# Altium schematic sheet Modbus.SchDoc: Ethernet
size A4; SheetNumber: 5; SheetTotal: 6
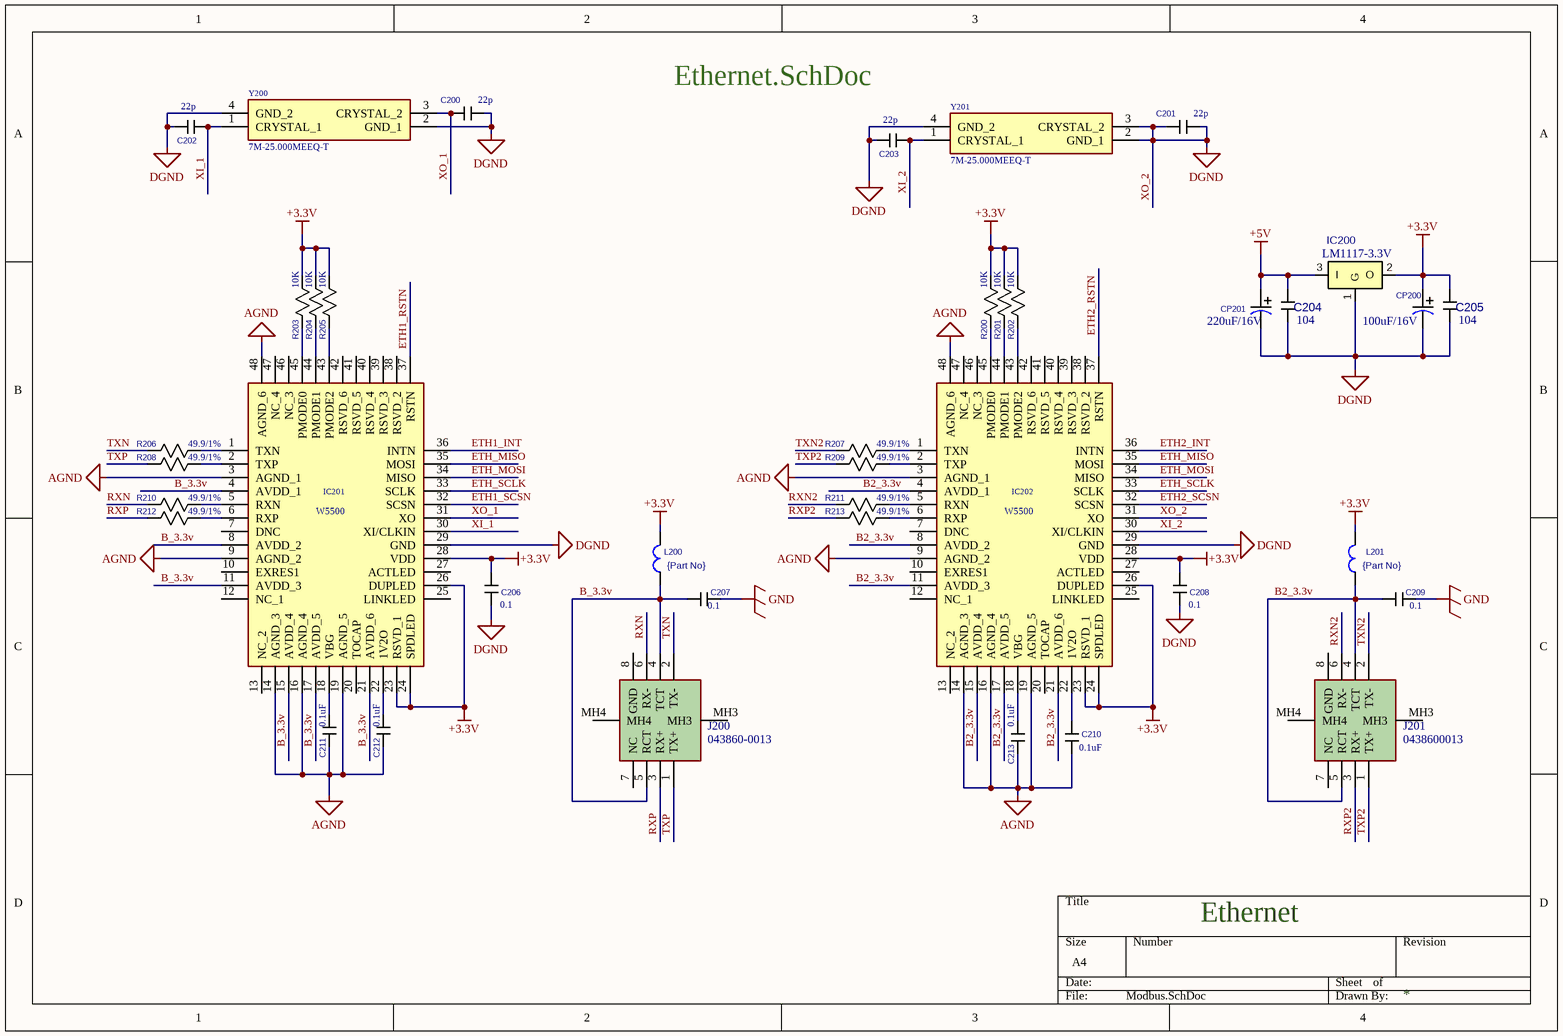
[diagram p0: Modbus.SchDoc]

## Parts
C200  규격: 22p  [CC1608]  (hidden comment: CS1608)
C201  규격: 22p  [CC1608]  (hidden comment: CS1608)
C202  규격: 22p  [CC1608]  (hidden comment: CS1608)
C203  규격: 22p  [CC1608]  (hidden comment: CS1608)
C204  규격: 104  [CC1608]  (hidden comment: CS1608)
C205  규격: 104  [CC1608]  (hidden comment: CS1608)
C206  규격: 0.1  [CC1608]  (hidden comment: CS1608)
C207  규격: 0.1  [CC1608]  (hidden comment: CS1608)
C208  규격: 0.1  [CC1608]  (hidden comment: CS1608)
C209  규격: 0.1  [CC1608]  (hidden comment: CS1608)
C210  규격: 0.1uF  [CC1608]  (hidden comment: CS1608)
C211  규격: 0.1uF  [CC1608]  (hidden comment: CS1608)
C212  규격: 0.1uF  [CC1608]  (hidden comment: CS1608)
C213  규격: 0.1uF  [CC1608]  (hidden comment: CS1608)
CP200  규격: 100uF/16V  [CP5_SMT]  (hidden comment: CP5_SMT)
CP201  규격: 220uF/16V  [CP6_SMT]  (hidden comment: CP6_SMT)
IC200  Part No.: LM1117-3.3V  [SOT-223]  (hidden comment: 1117SO)
IC201  W5500  [QFP50P900X900X160-48N]
IC202  W5500  [QFP50P900X900X160-48N]
J200  043860-0013  [0438600013]
J201  0438600013  [0438600013]
L200  Part No.: {Part No}  [BEADC2012X110N]  (hidden comment: L)
L201  Part No.: {Part No}  [BEADC2012X110N]  (hidden comment: L)
R200  규격: 10K  [R1608N]  (hidden comment: R1608)
R201  규격: 10K  [R1608N]  (hidden comment: R1608)
R202  규격: 10K  [R1608N]  (hidden comment: R1608)
R203  규격: 10K  [R1608N]  (hidden comment: R1608)
R204  규격: 10K  [R1608N]  (hidden comment: R1608)
R205  규격: 10K  [R1608N]  (hidden comment: R1608)
R206  규격: 49.9/1%  [R1608N]  (hidden comment: R1608)
R207  규격: 49.9/1%  [R1608N]  (hidden comment: R1608)
R208  규격: 49.9/1%  [R1608N]  (hidden comment: R1608)
R209  규격: 49.9/1%  [R1608N]  (hidden comment: R1608)
R210  규격: 49.9/1%  [R1608N]  (hidden comment: R1608)
R211  규격: 49.9/1%  [R1608N]  (hidden comment: R1608)
R212  규격: 49.9/1%  [R1608N]  (hidden comment: R1608)
R213  규격: 49.9/1%  [R1608N]  (hidden comment: R1608)
Y200  7M-25.000MEEQ-T  [7M25000MEEQT]
Y201  7M-25.000MEEQ-T  [7M25000MEEQT]

## Nets
+3.3V: C205.2 C206.2 C208.2 CP200.2 IC200.2(O) IC201.23(RSVD_1) IC201.24(SPDLED) IC201.26(DUPLED) IC201.28(VDD) IC202.23(RSVD_1) IC202.24(SPDLED) IC202.26(DUPLED) IC202.28(VDD) L200.1 L201.1 R200.1 R201.1 R202.1 R203.1 R204.1 R205.1
+5V: C204.2 CP201.2 IC200.3(I)
AGND: C210.2 C211.2 C212.2 C213.2 IC201.3(AGND_1) IC201.9(AGND_2) IC201.14(AGND_3) IC201.16(AGND_4) IC201.19(AGND_5) IC201.48(AGND_6) IC202.3(AGND_1) IC202.9(AGND_2) IC202.14(AGND_3) IC202.16(AGND_4) IC202.19(AGND_5) IC202.48(AGND_6)
GND: C207.1 C209.1
XO_2: C200.1 C201.1 C201.2 C202.2 C203.2 C204.1 C205.1 C206.1 C208.1 CP200.1 CP201.1 IC200.1(G) IC201.29(GND) IC202.29(GND) IC202.31(XO) Y200.2(GND_1) Y200.4(GND_2) Y201.2(GND_1) Y201.3(CRYSTAL_2) Y201.4(GND_2)  [also labelled DGND]
B2_3.3v: C209.2 IC202.4(AVDD_1) IC202.8(AVDD_2) IC202.11(AVDD_3) IC202.15(AVDD_4) IC202.17(AVDD_5) IC202.21(AVDD_6) J201.4(TCT) J201.5(RCT) L201.2
B_3.3v: C207.2 IC201.4(AVDD_1) IC201.8(AVDD_2) IC201.11(AVDD_3) IC201.15(AVDD_4) IC201.17(AVDD_5) IC201.21(AVDD_6) J200.4(TCT) J200.5(RCT) L200.2
ETH1_INT: IC201.36(INTN)
ETH1_RSTN: IC201.37(RSTN)
ETH1_SCSN: IC201.32(SCSN)
ETH2_INT: IC202.36(INTN)
ETH2_RSTN: IC202.37(RSTN)
ETH2_SCSN: IC202.32(SCSN)
ETH_MISO: IC201.35(MOSI) IC202.35(MOSI)
ETH_MOSI: IC201.34(MISO) IC202.34(MISO)
ETH_SCLK: IC201.33(SCLK) IC202.33(SCLK)
RXN: J200.6(RX-) R210.1
RXN2: J201.6(RX-) R211.1
RXP: J200.3(RX+) R212.1
RXP2: J201.3(RX+) R213.1
TXN: J200.2(TX-) R206.1
TXN2: J201.2(TX-) R207.1
TXP: J200.1(TX+) R208.1
TXP2: J201.1(TX+) R209.1
XI_1: C202.1 IC201.30(XI/CLKIN) Y200.1(CRYSTAL_1)
XI_2: C203.1 IC202.30(XI/CLKIN) Y201.1(CRYSTAL_1)
XO_1: C200.2 IC201.31(XO) Y200.3(CRYSTAL_2)
NetC210_1: C210.1 IC202.22(1V2O)
NetC211_1: C211.1 IC201.18(VBG)
NetC212_1: C212.1 IC201.22(1V2O)
NetC213_1: C213.1 IC202.18(VBG)
NetIC201_1: IC201.1(TXN) R206.2
NetIC201_2: IC201.2(TXP) R208.2
NetIC201_5: IC201.5(RXN) R210.2
NetIC201_6: IC201.6(RXP) R212.2
NetIC201_43: IC201.43(PMODE2) R205.2
NetIC201_44: IC201.44(PMODE1) R204.2
NetIC201_45: IC201.45(PMODE0) R203.2
NetIC202_1: IC202.1(TXN) R207.2
NetIC202_2: IC202.2(TXP) R209.2
NetIC202_5: IC202.5(RXN) R211.2
NetIC202_6: IC202.6(RXP) R213.2
NetIC202_43: IC202.43(PMODE2) R202.2
NetIC202_44: IC202.44(PMODE1) R201.2
NetIC202_45: IC202.45(PMODE0) R200.2

Not connected (* = marked no-connect by the designer): IC200 4; IC201 7(DNC) 10(EXRES1) 12(NC_1) 13(NC_2) 20(TOCAP) 25(LINKLED) 27(ACTLED) 38(RSVD_2) 39(RSVD_3) 40(RSVD_4) 41(RSVD_5) 42(RSVD_6) 46(NC_3) 47(NC_4); IC202 7(DNC) 10(EXRES1) 12(NC_1) 13(NC_2) 20(TOCAP) 25(LINKLED) 27(ACTLED) 38(RSVD_2) 39(RSVD_3) 40(RSVD_4) 41(RSVD_5) 42(RSVD_6) 46(NC_3) 47(NC_4); J200 7(NC) 8(GND) MH3 MH4; J201 7(NC) 8(GND) MH3 MH4

## Notes on the sheet
- Ethernet.SchDoc

## Library data of the parts
C200-C213 = CS1608: Part No.: {Part No}; Price: 6
CP200 = CP5_SMT: Part No.: {Part No}; Price: 31
CP201 = CP6_SMT: Part No.: RV16V220 6.3X7.7 (ELNA / 삼영); ComponentLink1Description: New link; ComponentLink1URL: *; Price: 40
IC200 = 1117SO: Value: {Value}; Price: {Price}
IC201 IC202 = W5500: Integrated Circuit; Manufacturer_Name: Wiznet Technology; Datasheet Link: https://docs.wiznet.io/img/products/w5500/W5500_ds_v110e.pdf; Height: 1.6mm; Manufacturer_Part_Number: W5500; Arrow Part Number: W5500; Arrow Price/Stock: https://www.arrow.com/en/products/w5500/wiznet?utm_currency=USD&region=nac
J200 J201 = 0438600013: Connector; Manufacturer_Name: Molex; Datasheet Link: https://www.molex.com/en-us/products/part-detail-pdf/438600013?display=pdf; Height: 13.78mm; Manufacturer_Part_Number: 0438600013; Mouser Part Number: N/A; Mouser Price/Stock: https://www.mouser.co.uk/ProductDetail/Molex/0438600013?qs=%252BdQmOuGyFcHPnpO4N3E7oA%3D%3D; Arrow Part Number: 0438600013; Arrow Price/Stock: https://www.arrow.com/en/products/0438600013/molex?utm_currency=USD&region=europe
L200 L201 = BEAD2012
R200-R213 = R1608: Part No.: {Part No}; Price: {Price}
Y200 Y201 = 7M-25.000MEEQ-T: Crystal or Oscillator; Manufacturer_Name: TXC CORPORATION; Datasheet Link: https://www.txccrystal.com/images/pdf/7m-accuracy.pdf; Height: 0.8mm; Manufacturer_Part_Number: 7M-25.000MEEQ-T; Mouser Part Number: 717-7M-25.000MEEQ-T; Mouser Price/Stock: https://www.mouser.co.uk/ProductDetail/TXC-Corporation/7M-25000MEEQ-T?qs=65dIHZNch5sP8qfwL3nyOQ%3D%3D; Arrow Part Number: 7M-25.000MEEQ-T; Arrow Price/Stock: https://www.arrow.com/en/products/7m-25.000meeq-t/txc-corporation?region=nac